# Altium schematic sheet TOFDeck.SchDoc
size A4; SheetNumber: 1; SheetTotal: 1
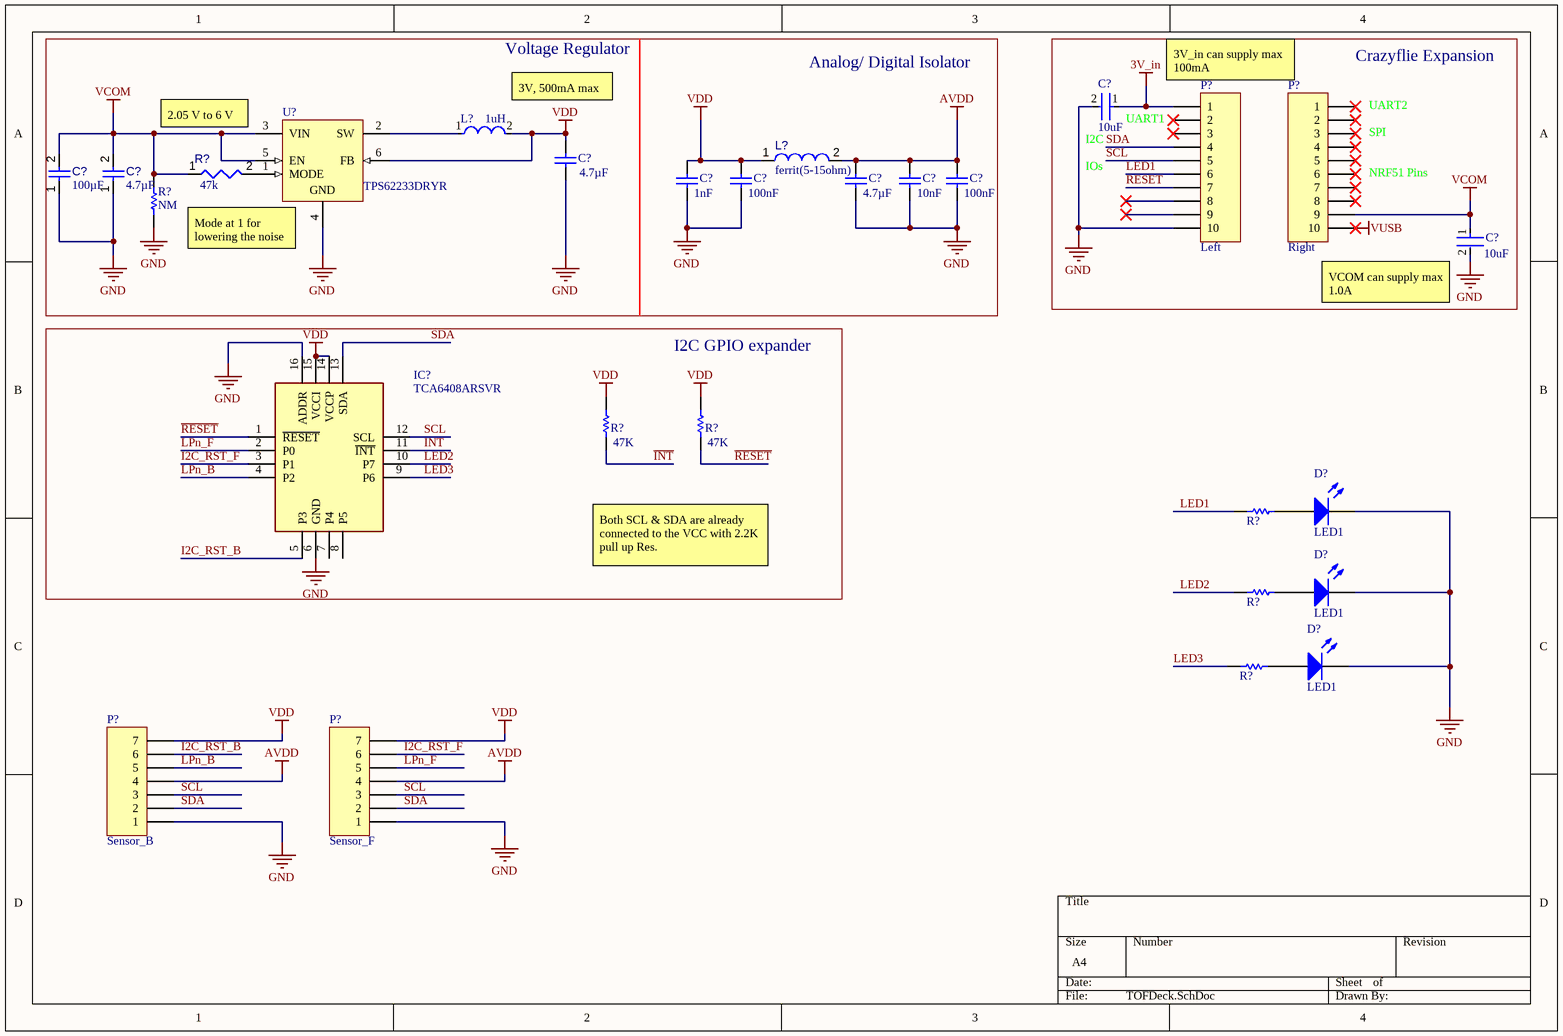
[diagram p0: TOFDeck.SchDoc]

## Parts
(Parts that share a designator on the sheet are numbered #1, #2 ... from top to bottom, then left to right.)
C?#1  Capacitance: 10uF  [FP-GRM188-0_1-e0_2_0_55-IPC_A]  (hidden comment: GRM188R60J106ME47D)
C?#2  Capacitance: 4.7µF  [CAPC1005X65X10ML15]  (hidden comment: C1005X5R0J475K050BC)
C?#3  value 100µF  [CAPC0805(2012)145_L]  (hidden comment: Capacitor 100µF +/-20% 6.3V 0805)
C?#4  value 4.7µF  [CAPC0603(1608)100_L]  (hidden comment: Capacitor 4.7µF +/-20% 10V 0603)
C?#5  Capacitance: 1nF  [CAPC1005X65X10ML15]  (hidden comment: C1005X5R0J475K050BC)
C?#6  Capacitance: 100nF  [CAPC1005X65X10ML15]  (hidden comment: C1005X5R0J475K050BC)
C?#7  Capacitance: 4.7µF  [CAPC1005X65X10ML15]  (hidden comment: C1005X5R0J475K050BC)
C?#8  Capacitance: 10nF  [CAPC1005X65X10ML15]  (hidden comment: C1005X5R0J475K050BC)
C?#9  Capacitance: 100nF  [CAPC1005X65X10ML15]  (hidden comment: C1005X5R0J475K050BC)
C?#10  Capacitance: 10uF  [FP-GRM188-0_1-e0_2_0_55-IPC_A]  (hidden comment: GRM188R60J106ME47D)
D?#1  LED1  [6-0805_M]
D?#2  LED1  [6-0805_M]
D?#3  LED1  [6-0805_M]
IC?  TCA6408ARSVR  [QFN40P180X260X55-16N]
L?#1  Inductance: 1uH  [FP-DFE201612C-MFG]  (hidden comment: 1286AS-H-1R0M=P2)
L?#2  value ferrit(5-15ohm)  [MURA-LQP15MN3N6B02D-2_M]  (hidden comment: LQP15MN3N6B02D)
P?#1  Left  [PCBComponent_1]
P?#2  Right  [PCBComponent_1]
P?#3  Sensor_B  [PCBComponent_1]
P?#4  Sensor_F  [PCBComponent_1]
R?#1  value 47k  [RESC1005X40X25LL05T05]  (hidden comment: Resistor 4k7 +/-1% 0402 100 mW)
R?#2  NM  [RESC1608X55X30ML20T20]
R?#3  47K  [RESC1608X55X30ML20T20]
R?#4  47K  [RESC1608X55X30ML20T20]
R?#5  ERA3AEB912V  [RESC1608X55X30ML20T20]  (value not drawn)
R?#6  ERA3AEB912V  [RESC1608X55X30ML20T20]  (value not drawn)
R?#7  ERA3AEB912V  [RESC1608X55X30ML20T20]  (value not drawn)
U?  TPS62233DRYR  [DRY0006A]

## Blocks framed on the sheet
Crazyflie Expansion: C?#1 C?#10 P?#1 P?#2
I2C GPIO expander: IC? R?#3 R?#4

## Nets
3V_in: C?#1.1 P?#1.1
AVDD: C?#7.2 C?#8.2 C?#9.2 L?#2.2 P?#3.4 P?#4.4
GND: C?#1.2 C?#2.1 C?#3.1 C?#4.1 C?#5.1 C?#6.1 C?#7.1 C?#8.1 C?#9.1 C?#10.2 D?#1.2(K) D?#2.2(K) D?#3.2(K) IC?.6(GND) IC?.16(ADDR) P?#1.10 P?#3.1 P?#4.1 R?#2.2 U?.4(GND)
VCOM: C?#3.2 C?#4.2 C?#10.1 P?#2.9 R?#1.1 R?#2.1 U?.3(VIN) U?.5(EN)
VDD: C?#2.2 C?#5.2 C?#6.2 IC?.14(VCCP) IC?.15(VCCI) L?#1.2 L?#2.1 P?#3.7 P?#4.7 R?#3.2 R?#4.2 U?.6(FB)
VUSB: P?#2.10
~{INT}: IC?.11(~{INT}) R?#3.1
~{RESET}: IC?.1(~{RESET}) P?#1.7 R?#4.1
I2C_RST_B: IC?.5(P3) P?#3.6
I2C_RST_F: IC?.3(P1) P?#4.6
LED1: P?#1.6 R?#5.1
LED2: IC?.10(P7) R?#6.1
LED3: IC?.9(P6) R?#7.1
LPn_B: IC?.4(P2) P?#3.5
LPn_F: IC?.2(P0) P?#4.5
SCL: IC?.12(SCL) P?#1.5 P?#3.3 P?#4.3
SDA: IC?.13(SDA) P?#1.4 P?#3.2 P?#4.2
NetD?#1_1: D?#1.1(A) R?#5.2
NetD?#2_1: D?#2.1(A) R?#6.2
NetD?#3_1: D?#3.1(A) R?#7.2
NetL?#1_1: L?#1.1 U?.2(SW)
NetR?#1_2: R?#1.2 U?.1(MODE)

Not connected (* = marked no-connect by the designer): IC? 7(P4) 8(P5); P?#1 2* 3* 8* 9*; P?#2 1* 2* 3* 4* 5* 6* 7* 8*

## Notes on the sheet
- Voltage Regulator
- 3V, 500mA max
- Analog/ Digital Isolator
- (near P?#1) 3V_in can supply max 100mA
- (near P?#2) UART2
- 2.05 V to 6 V
- (near C?#1) I2C
- IOs
- (near C?#1) UART1
- (near P?#2) SPI
- (near P?#2) NRF51 Pins
- (near U?) Mode at 1 for lowering the noise
- VCOM can supply max 1.0A
- Both SCL & SDA are already connected to the VCC with 2.2K pull up Res.

## Library data of the parts
C?#1 C?#10 = CMP-2006-02792-2: Chip Multilayer Ceramic Capacitors for General Purpose, 0603, 10uF, X5R, 15%, 20%, 6.3V; Packaging: Tape and Reel; Voltage Rating (DC): 6.3V; Width: 0.031inch; Termination: SMD/SMT; Dielectric: X5R; Package Quantity: 4000; Voltage Rating: 6.3V; Case/Package: 0603; Min Operating Temperature: -55°C; Voltage: 6.3V; Length: 1.6mm; Thickness: 0.035inch; Lead Free: Lead Free; Depth: 0.8mm; Case Code (Imperial): 0603; Max Operating Temperature: 85°C; Material: Ceramic; Height: 0.8mm; Tolerance: 20%; Mount: Surface Mount; REACH SVHC: No SVHC; Radiation Hardening: No; Case Code (Metric): 1608
C?#2 C?#5-C?#9 = CMP-2000-05437-1: Chip Capacitor, 4.7 uF, +/- 10%, 6.3 V, -55 to 85 degC, 0402 (1005 Metric), RoHS, Tape and Reel; PCN Part Number: MLCCPartNumberChange30/Nov/2012; Manufacturer: TDK; Online Catalog: CSeries,GeneralPurpose; Voltage - Rated: 6.3V; Product Training Modules: CSeriesGeneralApplicationsSEAT,CCV,andTVCLDesignToolsGuidetoReplacinganElectrolyticCapacitorwithanMLCC; Other Names: 445-5947-6; Temperature Coefficient: X5R; Package / Case: 0402(1005Metric); RoHS Information: RoHSCertificate-MLCC; Datasheet URL: https://datasheet.ciiva.com/24216/c1005x5r0j475k050bc-264315-24216570.pdf; Standard Package: 1; Manufacturer URL: http://www.tdk.com/; Lead Style: -; Series: C; Thickness (Max): 0.022"(0.55mm); Family: CeramicCapacitors; Tolerance: ±10%; Operating Temperature: -55degC~85degC; Applications: GeneralPurpose; Mounting Type: SurfaceMount,MLCC; Lead Spacing: -; Features: -; Packaging: Digi-Reel; Ratings: -; Size / Dimension: 0.039"Lx0.020"W(1.00mmx0.50mm); Category: Capacitors; Datasheet Version: Sep-13; Height - Seated (Max): -
C?#3 = CMP-001-00054-4: Chip Capacitor, 100µF +/-20%, 6.3V, 0805, Thickness 1.45 mm; Tolerance: 10%; Min Operating Temperature: -55°C; Max Operating Temperature: 85°C; Pins: 2; Mounting Technology: SMT; Case/Package: 0805; Voltage Rating: 6.3V
C?#4 = CMP-001-00076-4: Chip Capacitor, 4.7µF +/-20%, 6.3V, 0603, Thickness 1 mm; Tolerance: 10%; Mounting Technology: SMT; Case/Package: 0603; Pins: 2; Min Operating Temperature: -55°C; Max Operating Temperature: 85°C; Voltage Rating: 10V
D?#1-D?#3 = LED1: Typical RED GaAs LED; Published: 8-Jun-2000; LatestRevisionDate: 08-Jul-2005; LatestRevisionNote: Mech Layer 1 removed.; PackageReference: LED-1; Publisher: Altium Limited; PackageDescription: LED; 2 Leads
IC? = TCA6408ARSVR: Integrated Circuit; Manufacturer_Name: Texas Instruments; Datasheet Link: http://www.ti.com/lit/gpn/tca6408a; Height: 0.55mm; Manufacturer_Part_Number: TCA6408ARSVR; Mouser Part Number: 595-TCA6408ARSVR; Mouser Price/Stock: https://www.mouser.co.uk/ProductDetail/Texas-Instruments/TCA6408ARSVR?qs=AFkNxQkJKAISZm6jGsM%252BSQ%3D%3D; Arrow Part Number: TCA6408ARSVR; Arrow Price/Stock: https://www.arrow.com/en/products/tca6408arsvr/texas-instruments?region=nac
L?#1 = CMP-06042-000171-1: FIXED IND 1UH 2.5A 82 MOHM SMD; Tolerance: 20%; Core Material: Ferrite; Max DC Current: 2.3A; Shielding: Shielded; DC Resistance (DCR): 82mR; Test Frequency: 1MHz; Packaging: Tape and Reel; Case Code (Metric): 2016; Depth: 1.6mm; Min Operating Temperature: -40°C; Current Rating: 2.5A; Case/Package: 0806; Case Code (Imperial): 0806; Height - Seated (Max): 0.047inch; Length: 0.079inch; Max Operating Temperature: 85°C; Mount: Surface Mount; Resistor Type: Wirewound; Width: 0.063inch
L?#2 = CMP-006-00010-6: Inductor, 500 MHz, 170 mA, 0.5 Ohm, -40 to 85 degC, 01005 (0402 Metric), RoHS, Tape and Reel; Manufacturer: Murata; Core Material: Ferrite; Self Resonant Frequency: 6GHz; Current Rating: 170mA; Shielding: Unshielded; Q Factor: 13; Datasheet URL: http://download.siliconexpert.com/pdfs/2016/4/21/8/25/31/646/mrt_/manual/797549851250188lqp15mn3n6b0223.pdf; Datasheet Version: Apr-16; Case/Package: 0402; Mounting Technology: SM; Min Operating Temperature: -40°C; RoHS Compliant: True; Package Description: 2-Pin Surface Mount Device, Body 1 x 0.5 mm; Max Operating Temperature: 85°C; Package Quantity: 10000; Package Reference: 0402; Packaging: TapeandReel
P?#1 P?#2 = MHDR1X10: Header, 10-Pin; LatestRevisionDate: 17-Jul-2002; LatestRevisionNote: Re-released for DXP Platform.; Publisher: Altium Limited
P?#3 P?#4 = Header 7: Header, 7-Pin; LatestRevisionDate: 17-Jul-2002; LatestRevisionNote: Re-released for DXP Platform.; Publisher: Altium Limited
R?#1 = CMP-009-00030-5: Chip Resistor, 4.7 KOhm, +/- 1%, 0.1 W, -55 to 155 degC, 0402 (1005 Metric); Power: 100mW; Voltage Rating: 50V; Mounting Technology: SM; RoHS Compliant: True; Tolerance: 1%; Min Operating Temperature: -55°C; Max Operating Temperature: 155°C; Case/Package: 0402; Pins: 2
R?#2-R?#4 = CMP-2000-00140-1: Manufacturer: Panasonic; Part Number: ERA3AEB912V
R?#5-R?#7 = CMP-2000-00140-1: Manufacturer: Panasonic; Part Number: ERA3AEB912V
U? = CMP-0323-00281-3: Buck Step Down Regulator with 2.05 to 6 V Input and 3 V Output, -40 to 85 degC, 6-Pin SON (DRY), Green (RoHS & no Sb/Br); Manufacturer: Texas Instruments; Vin(Max)(V): 6; Synchronous Rectification: False; Regulated Outputs(#): 1; SubFamily: Step-Down Regulator; Rating: Catalog; Preset Vout(V): 3; Vin(Min)(V): 2.05; Iq(Typ)(mA): 0.022; Duty Cycle(Max)(%): 100; Switch Current Limit(Typ)(A): 0.84; Iout(Max)(A): 0.5; ComponentLink1URL: http://www.ti.com/general/docs/lit/getliterature.tsp?genericPartNumber=TPS62233&fileType=pdf; Eco-Plan: Green (RoHS & no Sb/Br); ComponentLink1Description: Datasheet; PackageDescription: 6-Pin Plastic Small Outline No-Lead, 1 x 1.45 x 0.6 mm Body, 0.5 mm Pitch; PartNumber: TPS62233DRYR; Topology: Buck; Vout(Min)(V): 3; ComponentLink2Description: Package Specification; DatasheetVersion: SLVS941E; ComponentLink3URL: Samples URL:http://www.ti.com/product/tps62233#samples; Vout(Max)(V): 3; ComponentLink2URL: http://www.ti.com/litv/pdf/mpds221e; PackageVersion: revF, Dec-2011; ComponentLink3Description: URL Link1; PackageReference: DRY0006A; Mounting Technology: Surface Mount